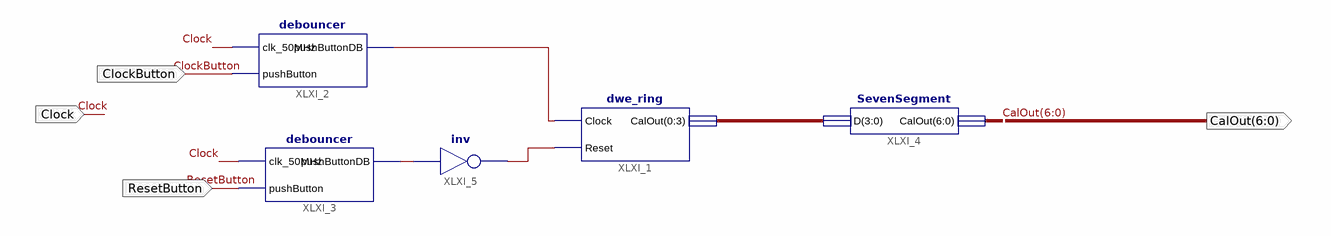
[diagram p0: schematic sheet 1]
// Xilinx ISE schematic top_extra.sch (spartan3) as structural Verilog: 5 symbols, 4 ports
module top_extra (
  input  ClockButton,
  input  ResetButton,
  input  Clock,
  output [6:0] CalOut
);

  wire XLXN_1, XLXN_5, XLXN_6;
  wire [3:0] XLXN_7;

  dwe_ring XLXI_1 (.CalOut({XLXN_7[0], XLXN_7[1], XLXN_7[2], XLXN_7[3]}), .Clock(XLXN_1), .Reset(XLXN_6));
  debouncer XLXI_2 (.clk_50MHz(Clock), .pushButton(ClockButton), .pushButtonDB(XLXN_1));
  debouncer XLXI_3 (.clk_50MHz(Clock), .pushButton(ResetButton), .pushButtonDB(XLXN_5));
  SevenSegment XLXI_4 (.D({XLXN_7[0], XLXN_7[1], XLXN_7[2], XLXN_7[3]}), .CalOut(CalOut));
  not XLXI_5 (XLXN_6, XLXN_5);

  // Notes on the sheet:
  //   LOC on signal CalOut(6:0) = J14,J15,H14,H15,G16,J13,M15
  //   LOC on signal ClockButton = P8
  //   LOC on signal ResetButton = A13
  //   LOC on signal Clock = E11
endmodule
